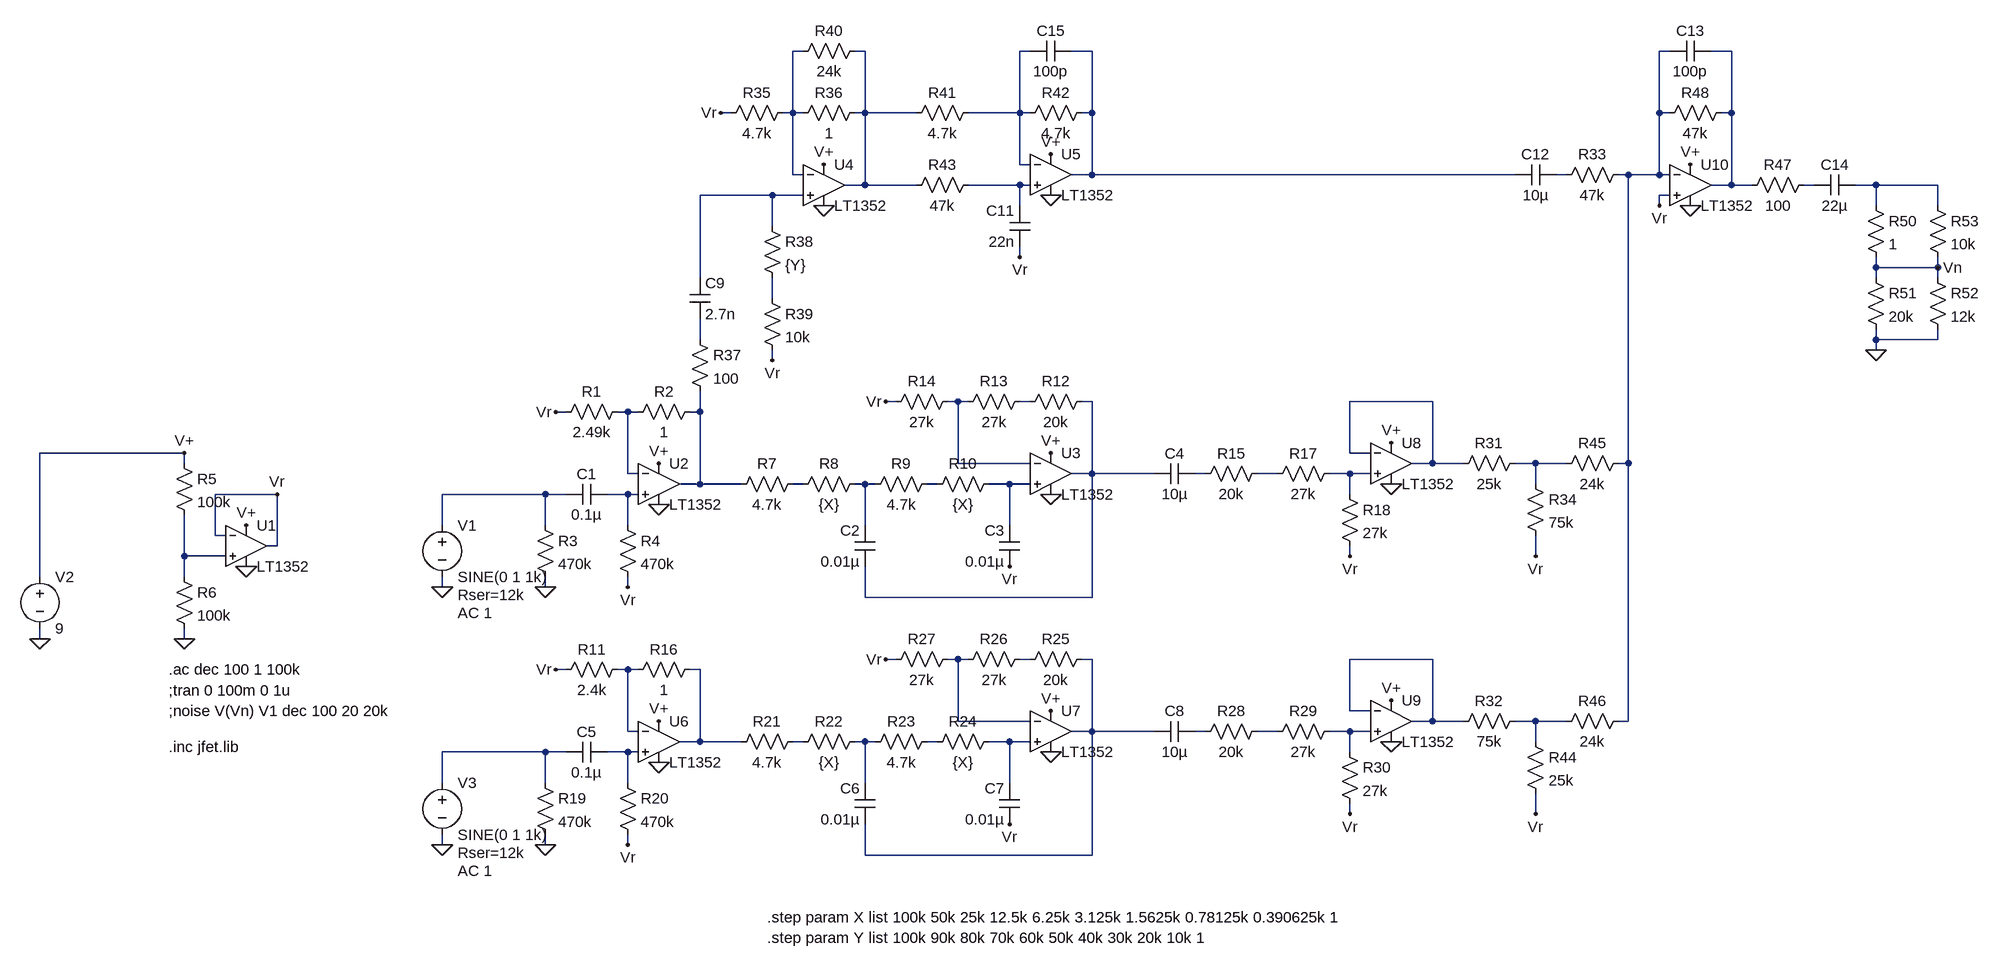
[diagram p0: schematic SVF.asc]
SVF.asc, the LTspice schematic file:
Version 4
SHEET 1 2440 868
WIRE 352 -544 336 -544
WIRE 448 -544 432 -544
WIRE 704 -544 688 -544
WIRE 800 -544 768 -544
WIRE 1696 -544 1680 -544
WIRE 1792 -544 1760 -544
WIRE 240 -448 224 -448
WIRE 336 -448 336 -544
WIRE 336 -448 320 -448
WIRE 352 -448 336 -448
WIRE 448 -448 448 -544
WIRE 448 -448 432 -448
WIRE 528 -448 448 -448
WIRE 688 -448 688 -544
WIRE 688 -448 608 -448
WIRE 704 -448 688 -448
WIRE 800 -448 800 -544
WIRE 800 -448 784 -448
WIRE 1680 -448 1680 -544
WIRE 1696 -448 1680 -448
WIRE 1792 -448 1792 -544
WIRE 1792 -448 1776 -448
WIRE 688 -368 688 -448
WIRE 704 -368 688 -368
WIRE 336 -352 336 -448
WIRE 352 -352 336 -352
WIRE 800 -352 800 -448
WIRE 800 -352 768 -352
WIRE 1456 -352 800 -352
WIRE 1536 -352 1520 -352
WIRE 1632 -352 1616 -352
WIRE 1680 -352 1680 -448
WIRE 1680 -352 1632 -352
WIRE 1696 -352 1680 -352
WIRE 448 -336 448 -448
WIRE 448 -336 416 -336
WIRE 528 -336 448 -336
WIRE 688 -336 608 -336
WIRE 704 -336 688 -336
WIRE 1792 -336 1792 -448
WIRE 1792 -336 1760 -336
WIRE 1824 -336 1792 -336
WIRE 1920 -336 1904 -336
WIRE 2016 -336 1984 -336
WIRE 2112 -336 2016 -336
WIRE 304 -320 192 -320
WIRE 352 -320 304 -320
WIRE 1696 -320 1680 -320
WIRE 688 -304 688 -336
WIRE 1680 -304 1680 -320
WIRE 2016 -304 2016 -336
WIRE 2112 -304 2112 -336
WIRE 304 -272 304 -320
WIRE 688 -224 688 -240
WIRE 2016 -208 2016 -224
WIRE 2112 -208 2112 -224
WIRE 2112 -208 2016 -208
WIRE 192 -192 192 -320
WIRE 2016 -192 2016 -208
WIRE 2112 -192 2112 -208
WIRE 304 -160 304 -192
WIRE 192 -96 192 -128
WIRE 2016 -96 2016 -112
WIRE 2112 -96 2112 -112
WIRE 2112 -96 2016 -96
WIRE 2016 -80 2016 -96
WIRE 304 -64 304 -80
WIRE 496 0 480 0
WIRE 592 0 576 0
WIRE 608 0 592 0
WIRE 704 0 688 0
WIRE 800 0 784 0
WIRE 1328 0 1200 0
WIRE -16 16 -32 16
WIRE 80 16 64 16
WIRE 96 16 80 16
WIRE 192 16 192 -16
WIRE 192 16 176 16
WIRE -608 80 -832 80
WIRE 1200 80 1200 0
WIRE 1232 80 1200 80
WIRE -608 96 -608 80
WIRE 592 96 592 0
WIRE 704 96 592 96
WIRE 1328 96 1328 0
WIRE 1328 96 1296 96
WIRE 1376 96 1328 96
WIRE 1488 96 1456 96
WIRE 1536 96 1488 96
WIRE 1632 96 1632 -352
WIRE 1632 96 1616 96
WIRE 80 112 80 16
WIRE 96 112 80 112
WIRE 800 112 800 0
WIRE 800 112 768 112
WIRE 896 112 800 112
WIRE 976 112 960 112
WIRE 1088 112 1056 112
WIRE 1200 112 1168 112
WIRE 1232 112 1200 112
WIRE 192 128 192 16
WIRE 192 128 160 128
WIRE 256 128 192 128
WIRE 352 128 336 128
WIRE 448 128 432 128
WIRE 464 128 448 128
WIRE 560 128 544 128
WIRE 672 128 640 128
WIRE 704 128 672 128
WIRE 1488 128 1488 96
WIRE -464 144 -560 144
WIRE -48 144 -208 144
WIRE -16 144 -48 144
WIRE 80 144 48 144
WIRE 96 144 80 144
WIRE 1200 144 1200 112
WIRE -208 192 -208 144
WIRE -48 192 -48 144
WIRE 80 192 80 144
WIRE 448 192 448 128
WIRE 672 192 672 128
WIRE -560 208 -560 144
WIRE -544 208 -560 208
WIRE -464 224 -464 144
WIRE -464 224 -480 224
WIRE -608 240 -608 176
WIRE -544 240 -608 240
WIRE 1200 240 1200 224
WIRE 1488 240 1488 208
WIRE -832 272 -832 80
WIRE -608 272 -608 240
WIRE -208 288 -208 272
WIRE -48 288 -48 272
WIRE 80 288 80 272
WIRE 448 304 448 256
WIRE 800 304 800 112
WIRE 800 304 448 304
WIRE -832 368 -832 352
WIRE -608 368 -608 352
WIRE 496 400 480 400
WIRE 592 400 576 400
WIRE 608 400 592 400
WIRE 704 400 688 400
WIRE 800 400 784 400
WIRE 1328 400 1200 400
WIRE -16 416 -32 416
WIRE 80 416 64 416
WIRE 96 416 80 416
WIRE 192 416 176 416
WIRE 1200 480 1200 400
WIRE 1232 480 1200 480
WIRE 592 496 592 400
WIRE 704 496 592 496
WIRE 1328 496 1328 400
WIRE 1328 496 1296 496
WIRE 1376 496 1328 496
WIRE 1488 496 1456 496
WIRE 1536 496 1488 496
WIRE 1632 496 1632 96
WIRE 1632 496 1616 496
WIRE 80 512 80 416
WIRE 96 512 80 512
WIRE 800 512 800 400
WIRE 800 512 768 512
WIRE 896 512 800 512
WIRE 976 512 960 512
WIRE 1088 512 1056 512
WIRE 1200 512 1168 512
WIRE 1232 512 1200 512
WIRE 192 528 192 416
WIRE 192 528 160 528
WIRE 256 528 192 528
WIRE 352 528 336 528
WIRE 448 528 432 528
WIRE 464 528 448 528
WIRE 560 528 544 528
WIRE 672 528 640 528
WIRE 704 528 672 528
WIRE 1488 528 1488 496
WIRE -48 544 -208 544
WIRE -16 544 -48 544
WIRE 80 544 48 544
WIRE 96 544 80 544
WIRE 1200 544 1200 512
WIRE -208 592 -208 544
WIRE -48 592 -48 544
WIRE 80 592 80 544
WIRE 448 592 448 528
WIRE 672 592 672 528
WIRE 1200 640 1200 624
WIRE 1488 640 1488 608
WIRE -208 688 -208 672
WIRE -48 688 -48 672
WIRE 80 688 80 672
WIRE 448 704 448 656
WIRE 800 704 800 512
WIRE 800 704 448 704
FLAG -48 288 0
FLAG 80 288 Vr
FLAG -32 16 Vr
FLAG -208 288 0
FLAG 128 96 V+
FLAG 128 160 0
FLAG -608 368 0
FLAG -512 192 V+
FLAG -512 256 0
FLAG -608 80 V+
FLAG -832 368 0
FLAG -464 144 Vr
FLAG 736 80 V+
FLAG 736 144 0
FLAG 480 0 Vr
FLAG 1200 240 Vr
FLAG 224 -448 Vr
FLAG 384 -368 V+
FLAG 384 -304 0
FLAG 304 -64 Vr
FLAG 736 -384 V+
FLAG 736 -320 0
FLAG 672 256 Vr
FLAG 688 -224 Vr
FLAG -48 688 0
FLAG 80 688 Vr
FLAG -32 416 Vr
FLAG -208 688 0
FLAG 128 496 V+
FLAG 128 560 0
FLAG 736 480 V+
FLAG 736 544 0
FLAG 480 400 Vr
FLAG 1200 640 Vr
FLAG 672 656 Vr
FLAG 1488 240 Vr
FLAG 1488 640 Vr
FLAG 1728 -368 V+
FLAG 1728 -304 0
FLAG 1680 -304 Vr
FLAG 2016 -80 0
FLAG 2112 -208 Vn
FLAG 1264 64 V+
FLAG 1264 128 0
FLAG 1264 464 V+
FLAG 1264 528 0
SYMBOL res 80 0 R90
WINDOW 0 0 56 VBottom 2
WINDOW 3 32 56 VTop 2
SYMATTR InstName R1
SYMATTR Value 2.49k
SYMBOL res 192 0 R90
WINDOW 0 0 56 VBottom 2
WINDOW 3 32 56 VTop 2
SYMATTR InstName R2
SYMATTR Value 1
SYMBOL res -64 176 R0
SYMATTR InstName R3
SYMATTR Value 470k
SYMBOL res 64 176 R0
SYMATTR InstName R4
SYMATTR Value 470k
SYMBOL cap 48 128 R90
WINDOW 0 0 32 VBottom 2
WINDOW 3 32 32 VTop 2
SYMATTR InstName C1
SYMATTR Value 0.1µ
SYMBOL voltage -208 176 R0
WINDOW 123 24 152 Left 2
WINDOW 39 24 124 Left 2
SYMATTR Value2 AC 1
SYMATTR SpiceLine Rser=12k
SYMATTR InstName V1
SYMATTR Value SINE(0 1 1k)
SYMBOL res -624 80 R0
SYMATTR InstName R5
SYMATTR Value 100k
SYMBOL res -624 256 R0
SYMATTR InstName R6
SYMATTR Value 100k
SYMBOL voltage -832 256 R0
SYMATTR InstName V2
SYMATTR Value 9
SYMBOL res 352 112 R90
WINDOW 0 0 56 VBottom 2
WINDOW 3 32 56 VTop 2
SYMATTR InstName R7
SYMATTR Value 4.7k
SYMBOL res 448 112 R90
WINDOW 0 0 56 VBottom 2
WINDOW 3 32 56 VTop 2
SYMATTR InstName R8
SYMATTR Value {X}
SYMBOL res 560 112 R90
WINDOW 0 0 56 VBottom 2
WINDOW 3 32 56 VTop 2
SYMATTR InstName R9
SYMATTR Value 4.7k
SYMBOL res 656 112 R90
WINDOW 0 0 56 VBottom 2
WINDOW 3 32 56 VTop 2
SYMATTR InstName R10
SYMATTR Value {X}
SYMBOL cap 464 256 R180
WINDOW 0 24 56 Left 2
WINDOW 3 24 8 Left 2
SYMATTR InstName C2
SYMATTR Value 0.01µ
SYMBOL cap 688 256 R180
WINDOW 0 24 56 Left 2
WINDOW 3 24 8 Left 2
SYMATTR InstName C3
SYMATTR Value 0.01µ
SYMBOL res 800 -16 R90
WINDOW 0 0 56 VBottom 2
WINDOW 3 32 56 VTop 2
SYMATTR InstName R12
SYMATTR Value 20k
SYMBOL res 704 -16 R90
WINDOW 0 0 56 VBottom 2
WINDOW 3 32 56 VTop 2
SYMATTR InstName R13
SYMATTR Value 27k
SYMBOL res 592 -16 R90
WINDOW 0 0 56 VBottom 2
WINDOW 3 32 56 VTop 2
SYMATTR InstName R14
SYMATTR Value 27k
SYMBOL res 1072 96 R90
WINDOW 0 0 56 VBottom 2
WINDOW 3 32 56 VTop 2
SYMATTR InstName R15
SYMATTR Value 20k
SYMBOL res 1184 96 R90
WINDOW 0 0 56 VBottom 2
WINDOW 3 32 56 VTop 2
SYMATTR InstName R17
SYMATTR Value 27k
SYMBOL res 1184 128 R0
SYMATTR InstName R18
SYMATTR Value 27k
SYMBOL cap 960 96 R90
WINDOW 0 0 32 VBottom 2
WINDOW 3 32 32 VTop 2
SYMATTR InstName C4
SYMATTR Value 10µ
SYMBOL res 336 -464 R90
WINDOW 0 0 56 VBottom 2
WINDOW 3 32 56 VTop 2
SYMATTR InstName R35
SYMATTR Value 4.7k
SYMBOL res 448 -464 R90
WINDOW 0 0 56 VBottom 2
WINDOW 3 32 56 VTop 2
SYMATTR InstName R36
SYMATTR Value 1
SYMBOL res 176 -112 R0
SYMATTR InstName R37
SYMATTR Value 100
SYMBOL cap 176 -192 R0
SYMATTR InstName C9
SYMATTR Value 2.7n
SYMBOL res 288 -288 R0
SYMATTR InstName R38
SYMATTR Value {Y}
SYMBOL res 288 -176 R0
SYMATTR InstName R39
SYMATTR Value 10k
SYMBOL res 448 -560 R90
WINDOW 0 0 56 VBottom 2
WINDOW 3 32 56 VTop 2
SYMATTR InstName R40
SYMATTR Value 24k
SYMBOL res 624 -464 R90
WINDOW 0 0 56 VBottom 2
WINDOW 3 32 56 VTop 2
SYMATTR InstName R41
SYMATTR Value 4.7k
SYMBOL res 800 -464 R90
WINDOW 0 0 56 VBottom 2
WINDOW 3 32 56 VTop 2
SYMATTR InstName R42
SYMATTR Value 4.7k
SYMBOL res 512 -320 R270
WINDOW 0 32 56 VTop 2
WINDOW 3 0 56 VBottom 2
SYMATTR InstName R43
SYMATTR Value 47k
SYMBOL cap 704 -240 R180
WINDOW 0 24 56 Left 2
WINDOW 3 24 8 Left 2
SYMATTR InstName C11
SYMATTR Value 22n
SYMBOL Opamps\\LT1352 -512 160 R0
SYMATTR InstName U1
SYMBOL Opamps\\LT1352 128 64 R0
SYMATTR InstName U2
SYMBOL Opamps\\LT1352 736 48 R0
SYMATTR InstName U3
SYMBOL Opamps\\LT1352 384 -400 R0
SYMATTR InstName U4
SYMBOL Opamps\\LT1352 736 -416 R0
SYMATTR InstName U5
SYMBOL res 80 400 R90
WINDOW 0 0 56 VBottom 2
WINDOW 3 32 56 VTop 2
SYMATTR InstName R11
SYMATTR Value 2.4k
SYMBOL res 192 400 R90
WINDOW 0 0 56 VBottom 2
WINDOW 3 32 56 VTop 2
SYMATTR InstName R16
SYMATTR Value 1
SYMBOL res -64 576 R0
SYMATTR InstName R19
SYMATTR Value 470k
SYMBOL res 64 576 R0
SYMATTR InstName R20
SYMATTR Value 470k
SYMBOL cap 48 528 R90
WINDOW 0 0 32 VBottom 2
WINDOW 3 32 32 VTop 2
SYMATTR InstName C5
SYMATTR Value 0.1µ
SYMBOL voltage -208 576 R0
WINDOW 123 24 152 Left 2
WINDOW 39 24 124 Left 2
SYMATTR Value2 AC 1
SYMATTR SpiceLine Rser=12k
SYMATTR InstName V3
SYMATTR Value SINE(0 1 1k)
SYMBOL res 352 512 R90
WINDOW 0 0 56 VBottom 2
WINDOW 3 32 56 VTop 2
SYMATTR InstName R21
SYMATTR Value 4.7k
SYMBOL res 448 512 R90
WINDOW 0 0 56 VBottom 2
WINDOW 3 32 56 VTop 2
SYMATTR InstName R22
SYMATTR Value {X}
SYMBOL res 560 512 R90
WINDOW 0 0 56 VBottom 2
WINDOW 3 32 56 VTop 2
SYMATTR InstName R23
SYMATTR Value 4.7k
SYMBOL res 656 512 R90
WINDOW 0 0 56 VBottom 2
WINDOW 3 32 56 VTop 2
SYMATTR InstName R24
SYMATTR Value {X}
SYMBOL cap 464 656 R180
WINDOW 0 24 56 Left 2
WINDOW 3 24 8 Left 2
SYMATTR InstName C6
SYMATTR Value 0.01µ
SYMBOL cap 688 656 R180
WINDOW 0 24 56 Left 2
WINDOW 3 24 8 Left 2
SYMATTR InstName C7
SYMATTR Value 0.01µ
SYMBOL res 800 384 R90
WINDOW 0 0 56 VBottom 2
WINDOW 3 32 56 VTop 2
SYMATTR InstName R25
SYMATTR Value 20k
SYMBOL res 704 384 R90
WINDOW 0 0 56 VBottom 2
WINDOW 3 32 56 VTop 2
SYMATTR InstName R26
SYMATTR Value 27k
SYMBOL res 592 384 R90
WINDOW 0 0 56 VBottom 2
WINDOW 3 32 56 VTop 2
SYMATTR InstName R27
SYMATTR Value 27k
SYMBOL res 1072 496 R90
WINDOW 0 0 56 VBottom 2
WINDOW 3 32 56 VTop 2
SYMATTR InstName R28
SYMATTR Value 20k
SYMBOL res 1184 496 R90
WINDOW 0 0 56 VBottom 2
WINDOW 3 32 56 VTop 2
SYMATTR InstName R29
SYMATTR Value 27k
SYMBOL res 1184 528 R0
SYMATTR InstName R30
SYMATTR Value 27k
SYMBOL cap 960 496 R90
WINDOW 0 0 32 VBottom 2
WINDOW 3 32 32 VTop 2
SYMATTR InstName C8
SYMATTR Value 10µ
SYMBOL Opamps\\LT1352 128 464 R0
SYMATTR InstName U6
SYMBOL Opamps\\LT1352 736 448 R0
SYMATTR InstName U7
SYMBOL cap 1520 -368 R90
WINDOW 0 0 32 VBottom 2
WINDOW 3 32 32 VTop 2
SYMATTR InstName C12
SYMATTR Value 10µ
SYMBOL res 1472 80 R90
WINDOW 0 0 56 VBottom 2
WINDOW 3 32 56 VTop 2
SYMATTR InstName R31
SYMATTR Value 25k
SYMBOL res 1632 -368 R90
WINDOW 0 0 56 VBottom 2
WINDOW 3 32 56 VTop 2
SYMATTR InstName R33
SYMATTR Value 47k
SYMBOL res 1472 112 R0
SYMATTR InstName R34
SYMATTR Value 75k
SYMBOL res 1472 512 R0
SYMATTR InstName R44
SYMATTR Value 25k
SYMBOL res 1632 80 R90
WINDOW 0 0 56 VBottom 2
WINDOW 3 32 56 VTop 2
SYMATTR InstName R45
SYMATTR Value 24k
SYMBOL res 1632 480 R90
WINDOW 0 0 56 VBottom 2
WINDOW 3 32 56 VTop 2
SYMATTR InstName R46
SYMATTR Value 24k
SYMBOL Opamps\\LT1352 1728 -400 R0
SYMATTR InstName U10
SYMBOL res 1920 -352 R90
WINDOW 0 0 56 VBottom 2
WINDOW 3 32 56 VTop 2
SYMATTR InstName R47
SYMATTR Value 100
SYMBOL cap 1984 -352 R90
WINDOW 0 0 32 VBottom 2
WINDOW 3 32 32 VTop 2
SYMATTR InstName C14
SYMATTR Value 22µ
SYMBOL res 2000 -320 R0
SYMATTR InstName R50
SYMATTR Value 1
SYMBOL res 2000 -208 R0
SYMATTR InstName R51
SYMATTR Value 20k
SYMBOL res 2096 -208 R0
SYMATTR InstName R52
SYMATTR Value 12k
SYMBOL res 2096 -320 R0
SYMATTR InstName R53
SYMATTR Value 10k
SYMBOL cap 1760 -560 R90
WINDOW 0 0 32 VBottom 2
WINDOW 3 32 32 VTop 2
SYMATTR InstName C13
SYMATTR Value 100p
SYMBOL res 1792 -464 R90
WINDOW 0 0 56 VBottom 2
WINDOW 3 32 56 VTop 2
SYMATTR InstName R48
SYMATTR Value 47k
SYMBOL res 1472 480 R90
WINDOW 0 0 56 VBottom 2
WINDOW 3 32 56 VTop 2
SYMATTR InstName R32
SYMATTR Value 75k
SYMBOL cap 768 -560 R90
WINDOW 0 0 32 VBottom 2
WINDOW 3 32 32 VTop 2
SYMATTR InstName C15
SYMATTR Value 100p
SYMBOL Opamps\\LT1352 1264 32 R0
SYMATTR InstName U8
SYMBOL Opamps\\LT1352 1264 432 R0
SYMATTR InstName U9
TEXT -632 416 Left 2 !.ac dec 100 1 100k
TEXT -632 448 Left 2 !;tran 0 100m 0 1u
TEXT 296 800 Left 2 !.step param X list 100k 50k 25k 12.5k 6.25k 3.125k 1.5625k 0.78125k 0.390625k 1
TEXT 296 832 Left 2 !.step param Y list 100k 90k 80k 70k 60k 50k 40k 30k 20k 10k 1
TEXT -632 480 Left 2 !;noise V(Vn) V1 dec 100 20 20k
TEXT -632 536 Left 2 !.inc jfet.lib

The netlist it stands for:
* SVF.asc
R1 N018 Vr 2.49k
R2 N019 N018 1
R3 N028 0 470k
R4 N029 Vr 470k
C1 N029 N028 0.1µ
V1 N028 0 SINE(0 1 1k) AC 1 Rser=12k
R5 V+ N030 100k
R6 N030 0 100k
V2 V+ 0 9
R7 N024 N019 4.7k
R8 N025 N024 {X}
R9 N026 N025 4.7k
R10 N027 N026 {X}
C2 N016 N025 0.01µ
C3 Vr N027 0.01µ
R12 N016 N015 20k
R13 N015 N014 27k
R14 N014 Vr 27k
R15 N022 N021 20k
R17 N023 N022 27k
R18 N023 Vr 27k
C4 N021 N016 10µ
R35 N001 Vr 4.7k
R36 N002 N001 1
R37 N013 N019 100
C9 N011 N013 2.7n
R38 N011 N012 {Y}
R39 N012 Vr 10k
R40 N002 N001 24k
R41 N003 N002 4.7k
R42 N004 N003 4.7k
R43 N002 N008 47k
C11 Vr N008 22n
XU1 N030 Vr V+ 0 Vr LT1352  ; pins In+ In- V+ V- OUT
XU2 N029 N018 V+ 0 N019 LT1352  ; pins In+ In- V+ V- OUT
XU3 N027 N014 V+ 0 N016 LT1352  ; pins In+ In- V+ V- OUT
XU4 N011 N001 V+ 0 N002 LT1352  ; pins In+ In- V+ V- OUT
XU5 N008 N003 V+ 0 N004 LT1352  ; pins In+ In- V+ V- OUT
R11 N035 Vr 2.4k
R16 N036 N035 1
R19 N045 0 470k
R20 N046 Vr 470k
C5 N046 N045 0.1µ
V3 N045 0 SINE(0 1 1k) AC 1 Rser=12k
R21 N041 N036 4.7k
R22 N042 N041 {X}
R23 N043 N042 4.7k
R24 N044 N043 {X}
C6 N033 N042 0.01µ
C7 Vr N044 0.01µ
R25 N033 N032 20k
R26 N032 N031 27k
R27 N031 Vr 27k
R28 N039 N038 20k
R29 N040 N039 27k
R30 N040 Vr 27k
C8 N038 N033 10µ
XU6 N046 N035 V+ 0 N036 LT1352  ; pins In+ In- V+ V- OUT
XU7 N044 N031 V+ 0 N033 LT1352  ; pins In+ In- V+ V- OUT
C12 N007 N004 10µ
R31 N020 N017 25k
R33 N005 N007 47k
R34 N020 Vr 75k
R44 N037 Vr 25k
R45 N005 N020 24k
R46 N005 N037 24k
XU10 Vr N005 V+ 0 N006 LT1352  ; pins In+ In- V+ V- OUT
R47 N009 N006 100
C14 N010 N009 22µ
R50 N010 Vn 1
R51 Vn 0 20k
R52 Vn 0 12k
R53 N010 Vn 10k
C13 N006 N005 100p
R48 N006 N005 47k
R32 N037 N034 75k
C15 N004 N003 100p
XU8 N023 N017 V+ 0 N017 LT1352  ; pins In+ In- V+ V- OUT
XU9 N040 N034 V+ 0 N034 LT1352  ; pins In+ In- V+ V- OUT
.ac dec 100 1 100k
;tran 0 100m 0 1u
.step param X list 100k 50k 25k 12.5k 6.25k 3.125k 1.5625k 0.78125k 0.390625k 1
.step param Y list 100k 90k 80k 70k 60k 50k 40k 30k 20k 10k 1
;noise V(Vn) V1 dec 100 20 20k
.inc jfet.lib
.lib LTC.lib
.backanno
.end